# Altium project PCB_Project.PrjPcb (part 2 of 3)

## Sheet LED_JTAG.schdoc
size 297 x 210 mm; Symbol: Sheet-Symbol_A4; Company: 嘉立创EDA; Version: V1.0; Page Size: A4; @Project Name: prj_extend_and_core_board_7_8; @Page Count: 7; @Update Date: 2024-08-12; @Create Date: 2024-08-09; @Schematic Name: Schematic1; @Page No: 6; @Page Name: LED/JTAG; Device: Sheet-Symbol_A4
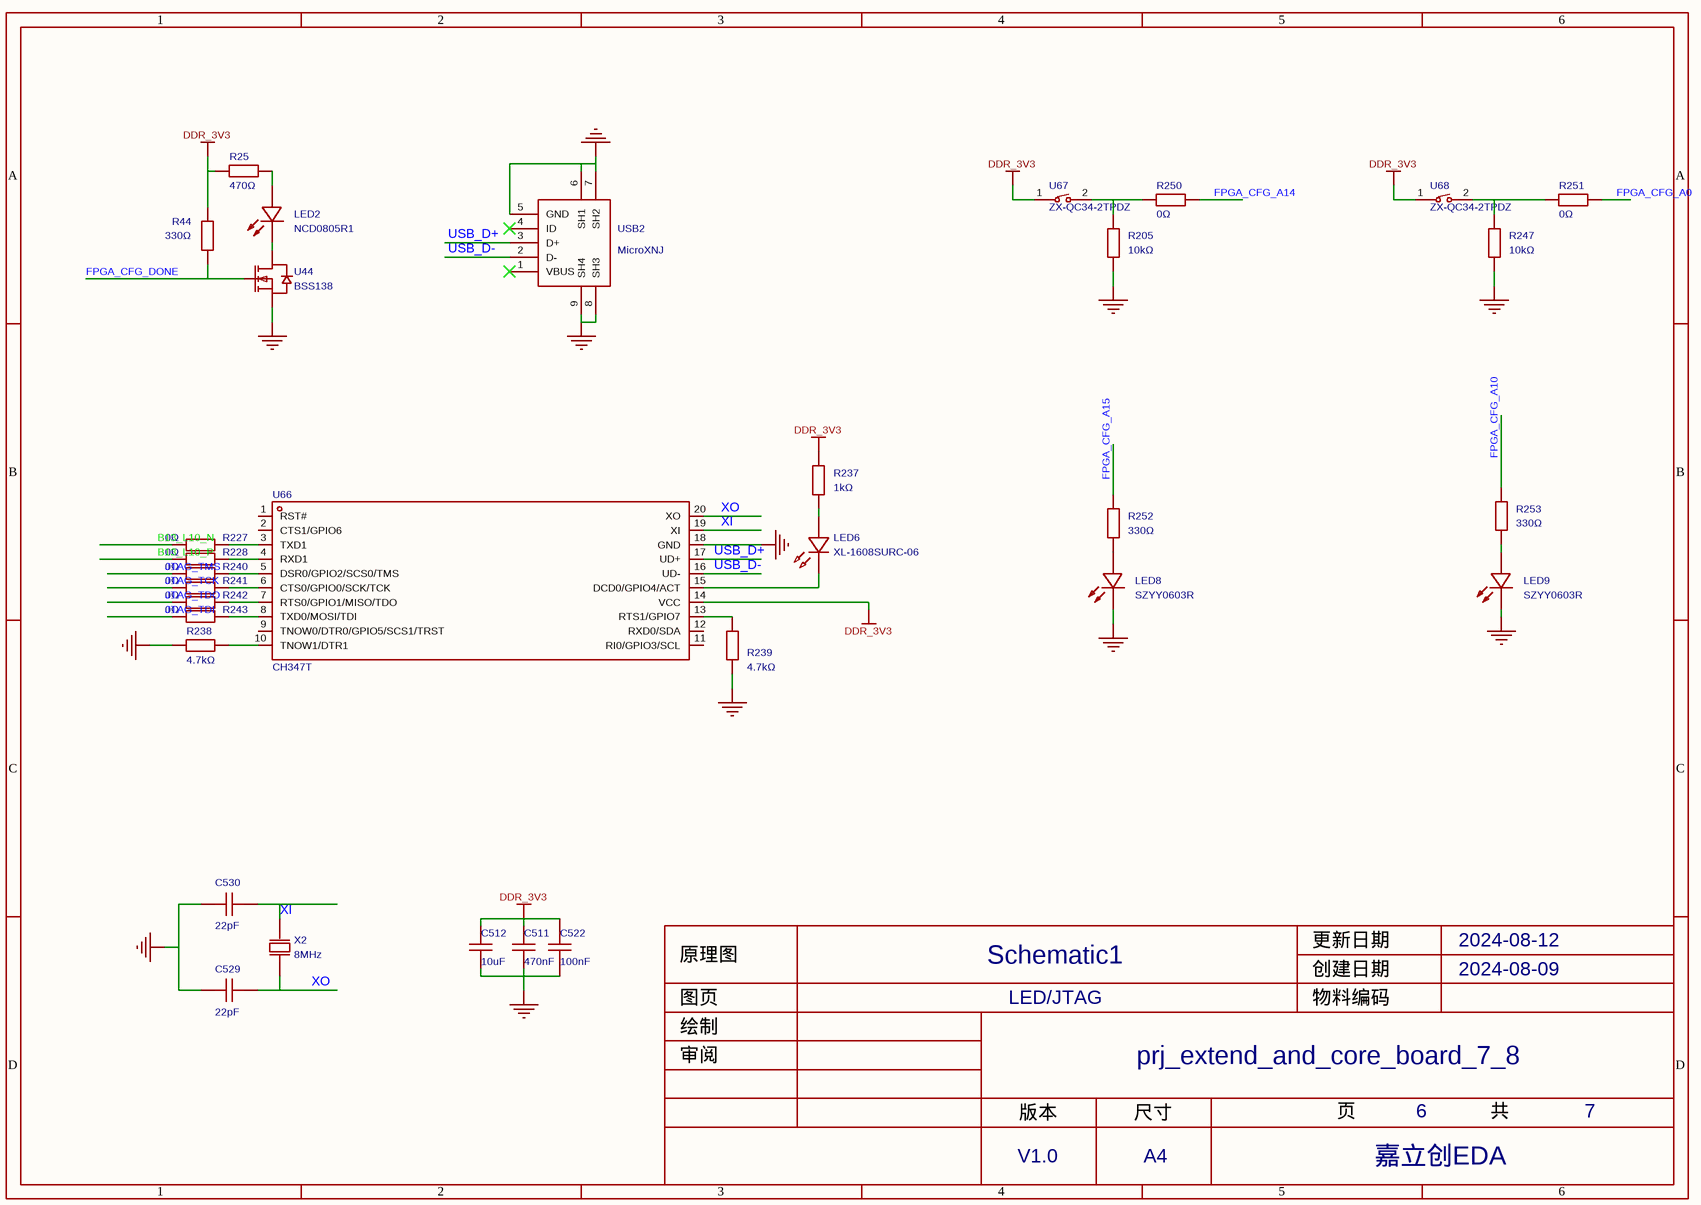
[diagram p7: LED_JTAG.schdoc]

### Parts
C511  470nF  [C0402]
C512  10uF  [C0402]
C522  100nF  [C0402]
C529  22pF  [C0402]
C530  22pF  [C0402]
LED2  NCD0805R1  [LED0805-R-RD]
LED6  XL-1608SURC-06  [LED0603-RD_RED]
LED8  SZYY0603R  [LED0603-R-RD]
LED9  SZYY0603R  [LED0603-R-RD]
R25  470Ω  [R0603]
R44  330Ω  [R0603]
R205  10kΩ  [R0603]
R227  0Ω  [R0402]
R228  0Ω  [R0402]
R237  1kΩ  [R0402]
R238  4.7kΩ  [R0402]
R239  4.7kΩ  [R0402]
R240  0Ω  [R0402]
R241  0Ω  [R0402]
R242  0Ω  [R0402]
R243  0Ω  [R0402]
R247  10kΩ  [R0603]
R250  0Ω  [R0402]
R251  0Ω  [R0402]
R252  330Ω  [R0402]
R253  330Ω  [R0402]
U44  BSS138  [SOT-23-3_L2.9-W1.3-P1.90-LS2.4-BR]
U66  CH347T  [TSSOP-20_L6.5-W4.4-P0.65-LS6.4-BL]
U67  ZX-QC34-2TPDZ  [KEY-SMD_L3.9-W3.0-LS5.0-EH]
U68  ZX-QC34-2TPDZ  [KEY-SMD_L3.9-W3.0-LS5.0-EH]
USB2  MicroXNJ  [MICRO-USB-SMD_MICROXNJ]
X2  8MHz  [CRYSTAL-SMD_L5.0-W3.2]

### Nets
DDR_3V3: C511.2 C512.2 C522.2 R25.2 R44.2 R237.2 U66.14(VCC) U67.1 U68.1
GND: C511.1 C512.1 C522.1 C529.2 C530.2 LED8.2(-) LED9.2(-) R205.1 R238.1 R239.1 R247.1 U44.2(S) U66.18(GND) USB2.5(GND) USB2.6(SH1) USB2.7(SH2) USB2.8(SH3) USB2.9(SH4)
B13_L10_N: R227.2
B13_L10_P: R228.2
FPGA_CFG_A0: R251.2
FPGA_CFG_A10: R253.2
FPGA_CFG_A14: R250.2
FPGA_CFG_A15: R252.2
FPGA_CFG_DONE: R44.1 U44.1(G)
JTAG_TCK: R241.2
JTAG_TDI: R243.2
JTAG_TDO: R242.2
JTAG_TMS: R240.2
USB_D+: U66.17(UD+) USB2.3(D+)
USB_D-: U66.16(UD-) USB2.2(D-)
XI: C530.1 U66.19(XI) X2.2(OSC2)
XO: C529.1 U66.20(XO) X2.1(OSC1)
NetLED2_1: LED2.1(+) R25.1
NetLED2_2: LED2.2(-) U44.3(D)
NetLED6_1: LED6.1(K) U66.15(DCD0/GPIO4/ACT)
NetLED6_2: LED6.2(A) R237.1
NetLED8_1: LED8.1(+) R252.1
NetLED9_1: LED9.1(+) R253.1
NetR205_2: R205.2 R250.1 U67.2
NetR227_1: R227.1 U66.3(TXD1)
NetR228_1: R228.1 U66.4(RXD1)
NetR238_2: R238.2 U66.10(TNOW1/DTR1)
NetR239_2: R239.2 U66.13(RTS1/GPIO7)
NetR240_1: R240.1 U66.5(DSR0/GPIO2/SCS0/TMS)
NetR241_1: R241.1 U66.6(CTS0/GPIO0/SCK/TCK)
NetR242_1: R242.1 U66.7(RTS0/GPIO1/MISO/TDO)
NetR243_1: R243.1 U66.8(TXD0/MOSI/TDI)
NetR247_2: R247.2 R251.1 U68.2

Not connected (* = marked no-connect by the designer): U66 1(RST#) 2(CTS1/GPIO6) 9(TNOW0/DTR0/GPIO5/SCS1/TRST) 11(RI0/GPIO3/SCL) 12(RXD0/SDA); USB2 1(VBUS)* 4(ID)*

### Notes on the sheet
- 1
- 2
- 3
- 4
- 5
- 6
- A
- B
- C
- 更新日期
- 2024-08-12
- 原理图
- 图页
- Schematic1
- LED/JTAG
- 创建日期
- 物料编码
- 2024-08-09
- D
- 审阅
- 绘制
- prj_extend_and_core_board_7_8
- 版本
- V1.0
- 尺寸
- A4
- 页
- 嘉立创EDA
- 共
- 7

### Library data of the parts
C511 = CL05A474KP5NNNC: 容值:470nF;精度:±10%;额定电压:10V;材质(温度系数):X5R;; Manufacturer: SAMSUNG(三星); AddInBom: yes; ModelId: 36a51122f27c49738f86b3bfa98863e0; ModelName: C0402_L1.0-W0.5-H0.5; ModelTransform: 39.37,19.685,0,0,0,0,0,0,0; Tolerance: ±10%; Voltage Rated: 10V; Temperature Coefficient: X5R; Symbol: CL05A474KP5NNNC; Device: CL05A474KP5NNNC; LCSC Part Name: 470nF ±10% 10V; SupplierPart: C47339; ManufacturerPart: CL05A474KP5NNNC; Supplier Footprint: 0402; JLCPCB Part Class: 扩展库; Datasheet: https://atta.szlcsc.com/upload/public/pdf/source/20160218/1457707763339.pdf; Supplier: LCSC; ConvertToPcb: yes; FootprintName: C0402; Value: 470nF
C512 = CL05A106MQ5NUNC: 容值:10uF;精度:±20%;额定电压:6.3V;材质(温度系数):X5R;; Manufacturer: SAMSUNG(三星); AddInBom: yes; ModelId: 36a51122f27c49738f86b3bfa98863e0; ModelName: C0402_L1.0-W0.5-H0.5; ModelTransform: 39.37,19.685,0,0,0,0,0,0,0; Tolerance: ±20%; Voltage Rated: 6.3V; Temperature Coefficient: X5R; Symbol: CL05A106MQ5NUNC; Device: CL05A106MQ5NUNC; Supplier: LCSC; Manufacturer Part: CL05A106MQ5NUNC; Value: 10uF; Supplier Part: C15525; JLCPCB Part Class: 基础库; LCSC Part Name: 10uF ±20% 6.3V; Supplier Footprint: 0402; Datasheet: https://atta.szlcsc.com/upload/public/pdf/source/20220823/2B02EE04F8F211D38A52DCB16EB6BEBA.pdf; ConvertToPcb: yes; FootprintName: C0402
C522 = GRM155R71C104KA88D: 容值:100nF;精度:±10%;额定电压:16V;材质(温度系数):X7R;; Manufacturer: muRata(村田); AddInBom: yes; ModelId: 36a51122f27c49738f86b3bfa98863e0; ModelName: C0402_L1.0-W0.5-H0.5; ModelTransform: 39.37,19.685,0,0,0,0,0,0,0; Tolerance: ±10%; Voltage Rated: 16V; Temperature Coefficient: X7R; Symbol: GRM155R71C104KA88D; Device: GRM155R71C104KA88D; LCSC Part Name: 100nF ±10% 16V; SupplierPart: C71629; ManufacturerPart: GRM155R71C104KA88D; Supplier Footprint: 0402; JLCPCB Part Class: 扩展库; Datasheet: https://atta.szlcsc.com/upload/public/pdf/source/20161108/1478586448742.pdf; Supplier: LCSC; ConvertToPcb: yes; FootprintName: C0402; Value: 100nF
C529 C530 = CC0402FRNPO9BN220: 容值:22pF;精度:±1%;额定电压:50V;材质(温度系数):NP0;; Manufacturer: YAGEO(国巨); AddInBom: yes; ModelId: 36a51122f27c49738f86b3bfa98863e0; ModelName: C0402_L1.0-W0.5-H0.5; ModelTransform: 39.37,19.685,0,0,0,0,0,0,0; Tolerance: ±1%; Voltage Rated: 50V; Temperature Coefficient: NP0; Symbol: CC0402FRNPO9BN220; Device: CC0402FRNPO9BN220; Supplier: LCSC; Supplier Part: C277482; Manufacturer Part: CC0402FRNPO9BN220; Value: 22pF; JLCPCB Part Class: 扩展库; LCSC Part Name: 22pF ±1% 50V; Supplier Footprint: 0402; Datasheet: https://atta.szlcsc.com/upload/public/pdf/source/20181008/C309499_21CC21451B82C39E3D92150FD6B30293.pdf; ConvertToPcb: yes; FootprintName: C0402
LED2 = NCD0805R1: 灯头类型:-;发光颜色:红色;正向电压(VF):1.6V~2.6V;功率:65mW;正向电流:20mA;主波长:615nm~630nm;二极管配置:独立二极管;透镜颜色:无色透明透镜;色温:-;发光强度:67mcd~195mcd;发光角度:130°;载带方式:-;工作温度:-30℃~+85℃;; Manufacturer: 国星光电; Symbol: FC-2012HRK-620D; AddInBom: yes; ModelId: 6ccd75a2b5134d6ab756ecf3c14a7290; ModelName: LED0805-RD; ModelTransform: 79.527,49.2125,0,0,0,0,0,0,0; Emitted Color: 红色; Power Dissipation: 65mW; Forward Current: 20mA; Diode Configuration: 独立二极管; Lens Color: 无色透明透镜; Viewing Angle: 130°; Device: NCD0805R1; Supplier: LCSC; Manufacturer Part: NCD0805R1; Supplier Part: C84256; JLCPCB Part Class: 基础库; LCSC Part Name: NCD0805R1; Supplier Footprint: 0805; Datasheet: https://atta.szlcsc.com/upload/public/pdf/source/20200820/C84256_F0A75A43B3EAD75808600A0514C76B99.pdf; ConvertToPcb: yes; FootprintName: LED0805-R-RD; Lamp Holder Type: -; Forward Voltage (VF): 1.6V~2.6V; Dominant Wavelength: 615nm~630nm; Peak Wavelength: -; Color Temperature: -; Luminous Intensity: 67mcd~195mcd; Mounting Sytle: -; Operating Temperature: -30℃~+85℃
LED6 = XL-1608SURC-06: 发光颜色:红色;功率:55mW;正向电流:25mA;主波长:617nm~621nm;透镜颜色:无色透明透镜;色温:-;发光角度:120°;载带方式:正贴;工作温度:-30℃~+85℃;; Manufacturer: XINGLIGHT(成兴光); AddInBom: yes; ModelId: 74041d3a270d435c8600a9ab9b7641c0; ModelTransform: 63.7794,31.496,0,0,0,0,0,0,0; Emitted Color: 红色; Power Dissipation: 55mW; Forward Current: 25mA; Peak Wavelength: 623nm; Lens Color: 无色透明透镜; Viewing Angle: 120°; Mounting Sytle: 正贴; Symbol: XL-1608SURC-06; Device: XL-1608SURC-06; Supplier: LCSC; Supplier Part: C965799; Manufacturer Part: XL-1608SURC-06; JLCPCB Part Class: 扩展库; LCSC Part Name: XL-1608SURC-06; Supplier Footprint: 0603; Datasheet: https://atta.szlcsc.com/upload/public/pdf/source/20221102/D860AFDD1CDB02C5A8064103A32707E2.pdf; ConvertToPcb: yes; FootprintName: LED0603-RD_RED; ModelName: LED0603-RD_RED; Dominant Wavelength: 617nm~621nm; Color Temperature: -; Operating Temperature: -30℃~+85℃
LED8 LED9 = SZYY0603R: 发光颜色:红色;功率:40mW;正向电流:20mA;主波长:615nm~630nm;二极管配置:-;透镜颜色:无色透明透镜;色温:-;发光角度:120°;载带方式:-;工作温度:-40℃~+85℃;; Manufacturer: yongyu(永裕光电); AddInBom: yes; ModelId: 8d3b40c214c440ee9cb5435c7b23d347; ModelTransform: 63.7794,31.496,0,0,0,0,0,0,0; Emitted Color: 红色; Power Dissipation: 40mW; Forward Current: 20mA; Peak Wavelength: 645nm; Lens Color: 无色透明透镜; Viewing Angle: 120°; Symbol: SZYY0603R; Device: SZYY0603R; LCSC Part Name: 红灯; SupplierPart: C434419; ManufacturerPart: SZYY0603R; Supplier Footprint: 0603; JLCPCB Part Class: 扩展库; Datasheet: https://atta.szlcsc.com/upload/public/pdf/source/20191204/C434419_0B955C1F73FF88449D9A795B6FF49070.pdf; Supplier: LCSC; ConvertToPcb: yes; FootprintName: LED0603-R-RD; ModelName: LED0603-R-RD; Dominant Wavelength: 615nm~630nm; Diode Configuration: -; Color Temperature: -; Mounting Sytle: -; Operating Temperature: -40℃~+85℃
R25 = 0603WAF4700T5E: 电阻类型:厚膜电阻;阻值:470Ω;精度:±1%;功率:100mW;最大工作电压:75V;温度系数:±100ppm/℃;; Manufacturer: UNI-ROYAL(厚声); AddInBom: yes; ModelId: fc143cca1e79419f9cd78b61e9279f08; ModelTransform: 31.8897,63.7794,0,90,0,0,0,0,0; Tolerance: ±1%; Power(Watts): 100mW; Overload Voltage (Max): 75V; Symbol: 0603WAF4700T5E; Device: 0603WAF4700T5E; Supplier: LCSC; Manufacturer Part: 0603WAF4700T5E; Supplier Part: C23179; Value: 470Ω; JLCPCB Part Class: 基础库; LCSC Part Name: 470Ω ±1% 100mW 厚膜电阻; Supplier Footprint: 0603; Datasheet: https://atta.szlcsc.com/upload/public/pdf/source/20200306/C422600_1E6D84923E4A46A82E41ADD87F860B5C.pdf; ConvertToPcb: yes; FootprintName: R0603; ModelName: R0603; Type: 厚膜电阻; Temperature Coefficient: ±100ppm/℃; Operating Temperature Range: -55℃~+155℃
R44 = 0603WAF3300T5E: 电阻类型:厚膜电阻;阻值:330Ω;精度:±1%;功率:100mW;最大工作电压:75V;温度系数:±100ppm/℃;; Manufacturer: UNI-ROYAL(厚声); AddInBom: yes; ModelId: fc143cca1e79419f9cd78b61e9279f08; ModelTransform: 31.8897,63.7794,0,90,0,0,0,0,0; Tolerance: ±1%; Power(Watts): 100mW; Overload Voltage (Max): 75V; Symbol: 0603WAF3300T5E; Device: 0603WAF3300T5E; Supplier: LCSC; Manufacturer Part: 0603WAF3300T5E; Supplier Part: C23138; Value: 330Ω; JLCPCB Part Class: 基础库; LCSC Part Name: 330Ω ±1% 100mW 厚膜电阻; Supplier Footprint: 0603; Datasheet: https://atta.szlcsc.com/upload/public/pdf/source/20200306/C422600_1E6D84923E4A46A82E41ADD87F860B5C.pdf; ConvertToPcb: yes; FootprintName: R0603; ModelName: R0603; Type: 厚膜电阻; Temperature Coefficient: ±100ppm/℃; Operating Temperature Range: -55℃~+155℃
R205 R247 = 0603WAF1002T5E: 电阻类型:厚膜电阻;阻值:10kΩ;精度:±1%;功率:100mW;最大工作电压:75V;温度系数:±100ppm/℃;; Manufacturer: UNI-ROYAL(厚声); AddInBom: yes; ModelId: fc143cca1e79419f9cd78b61e9279f08; ModelTransform: 31.8897,63.7794,0,90,0,0,0,0,0; Tolerance: ±1%; Power(Watts): 100mW; Overload Voltage (Max): 75V; Symbol: 0603WAF1002T5E; Device: 0603WAF1002T5E; Supplier: LCSC; Manufacturer Part: 0603WAF1002T5E; Supplier Part: C25804; Value: 10kΩ; JLCPCB Part Class: 基础库; LCSC Part Name: 厚膜电阻 10kΩ ±1% 100mW; Supplier Footprint: 0603; Datasheet: https://atta.szlcsc.com/upload/public/pdf/source/20200306/C422600_1E6D84923E4A46A82E41ADD87F860B5C.pdf; ConvertToPcb: yes; FootprintName: R0603; ModelName: R0603; Type: 厚膜电阻; Temperature Coefficient: ±100ppm/℃; Operating Temperature Range: -55℃~+155℃
R227 R228 R240-R243 R250 R251 = 0402WGF0000TCE: 电阻类型:厚膜电阻;阻值:0Ω;精度:±1%;功率:62.5mW;最大工作电压:50V;温度系数:±800ppm/℃;; Manufacturer: UNI-ROYAL(厚声); AddInBom: yes; ModelId: 671aefced39d4c318694bba8bd8efd39; ModelName: R0402_L1.0-W0.5-H0.5; ModelTransform: 39.37,19.685,0,0,0,0,0,0.0005,0; Tolerance: ±1%; Power(Watts): 62.5mW; Overload Voltage (Max): 50V; Symbol: 0402WGF0000TCE; Device: 0402WGF0000TCE; Supplier: LCSC; Manufacturer Part: 0402WGF0000TCE; Supplier Part: C17168; Value: 0Ω; JLCPCB Part Class: 基础库; LCSC Part Name: 0Ω ±1% 62.5mW 厚膜电阻; Supplier Footprint: 0402; Datasheet: https://atta.szlcsc.com/upload/public/pdf/source/20200306/C422600_1E6D84923E4A46A82E41ADD87F860B5C.pdf; ConvertToPcb: yes; FootprintName: R0402; Type: 厚膜电阻; Temperature Coefficient: ±800ppm/℃; Operating Temperature Range: -55℃~+155℃
R237 = 0402WGF1001TCE: 电阻类型:厚膜电阻;阻值:1kΩ;精度:±1%;功率:62.5mW;最大工作电压:50V;温度系数:±100ppm/℃;; Manufacturer: UNI-ROYAL(厚声); AddInBom: yes; ModelId: 671aefced39d4c318694bba8bd8efd39; ModelName: R0402_L1.0-W0.5-H0.5; ModelTransform: 39.37,19.685,0,0,0,0,0,0.0005,0; Tolerance: ±1%; Power(Watts): 62.5mW; Overload Voltage (Max): 50V; Symbol: 0402WGF1001TCE; Device: 0402WGF1001TCE; Supplier: LCSC; Manufacturer Part: 0402WGF1001TCE; Supplier Part: C11702; Value: 1kΩ; JLCPCB Part Class: 基础库; LCSC Part Name: 1kΩ ±1% 62.5mW 厚膜电阻; Supplier Footprint: 0402; Datasheet: https://atta.szlcsc.com/upload/public/pdf/source/20200306/C422600_1E6D84923E4A46A82E41ADD87F860B5C.pdf; ConvertToPcb: yes; FootprintName: R0402; Type: 厚膜电阻; Temperature Coefficient: ±100ppm/℃; Operating Temperature Range: -55℃~+155℃
R238 R239 = 0402WGF4701TCE: 电阻类型:厚膜电阻;阻值:4.7kΩ;精度:±1%;功率:62.5mW;最大工作电压:50V;温度系数:±100ppm/℃;; Manufacturer: UNI-ROYAL(厚声); AddInBom: yes; ModelId: 671aefced39d4c318694bba8bd8efd39; ModelName: R0402_L1.0-W0.5-H0.5; ModelTransform: 39.37,19.685,0,0,0,0,0,0.0005,0; Tolerance: ±1%; Power(Watts): 62.5mW; Overload Voltage (Max): 50V; Symbol: 0402WGF4701TCE; Device: 0402WGF4701TCE; Supplier: LCSC; Manufacturer Part: 0402WGF4701TCE; Supplier Part: C25900; Value: 4.7kΩ; JLCPCB Part Class: 基础库; LCSC Part Name: 4.7kΩ ±1% 62.5mW 厚膜电阻; Supplier Footprint: 0402; Datasheet: https://atta.szlcsc.com/upload/public/pdf/source/20200306/C422600_1E6D84923E4A46A82E41ADD87F860B5C.pdf; ConvertToPcb: yes; FootprintName: R0402; Type: 厚膜电阻; Temperature Coefficient: ±100ppm/℃; Operating Temperature Range: -55℃~+155℃
R252 R253 = 0402WGF3300TCE: 电阻类型:厚膜电阻;阻值:330Ω;精度:±1%;功率:62.5mW;最大工作电压:50V;温度系数:±100ppm/℃;; Manufacturer: UNI-ROYAL(厚声); AddInBom: yes; ModelId: 671aefced39d4c318694bba8bd8efd39; ModelName: R0402_L1.0-W0.5-H0.5; ModelTransform: 39.37,19.685,0,0,0,0,0,0.0005,0; Tolerance: ±1%; Power(Watts): 62.5mW; Overload Voltage (Max): 50V; Symbol: 0402WGF3300TCE; Device: 0402WGF3300TCE; Supplier: LCSC; Manufacturer Part: 0402WGF3300TCE; Supplier Part: C25104; Value: 330Ω; JLCPCB Part Class: 基础库; LCSC Part Name: 330Ω ±1% 62.5mW 厚膜电阻; Supplier Footprint: 0402; Datasheet: https://atta.szlcsc.com/upload/public/pdf/source/20200306/C422600_1E6D84923E4A46A82E41ADD87F860B5C.pdf; ConvertToPcb: yes; FootprintName: R0402; Type: 厚膜电阻; Temperature Coefficient: ±100ppm/℃; Operating Temperature Range: -55℃~+155℃
U44 = BSS138_C7420339: 类型:N沟道;漏源电压(Vdss):50V;连续漏极电流(Id):340mA;功率(Pd):350mW;导通电阻(RDS(on)@Vgs,Id):2.5Ω@10V,0.34A;阈值电压(Vgs(th)@Id):1.6V@250uA;; Manufacturer: 宏迦橙; AddInBom: yes; ModelId: c62791f0466c4ae2a892c056b845b0ca; ModelName: SOT-23-3P_L2.9-W1.3-H1.0-LS2.4-P0.95; ModelTransform: 98.425,114.173,0,180,0,0,0.0005,-0.0005,0; Drain Source Voltage (Vdss): 50V; Continuous Drain Current (Id): 340mA; Power Dissipation (Pd): 350mW; Total Gate Charge (Qg@Vgs): 1.7nC@10V; Input Capacitance (Ciss@Vds): 17.5pF@25V; Reverse Transfer Capacitance (Crss@Vds): 6.5pF@25V; Symbol: BSS138_C7420339; Device: BSS138_C7420339; Supplier: LCSC; Supplier Part: C7420339; Manufacturer Part: BSS138; JLCPCB Part Class: 扩展库; LCSC Part Name: N沟道 耐压:50V 电流:340mA; Supplier Footprint: SOT-23; Datasheet: https://atta.szlcsc.com/upload/public/pdf/source/20230828/FA091145E476A230936B8E03226CDB87.pdf; ConvertToPcb: yes; FootprintName: SOT-23-3_L2.9-W1.3-P1.90-LS2.4-BR; Type: N沟道; Drain Source On Resistance (RDS(on)@Vgs,Id): 2.5Ω@10V,0.34A; Gate Threshold Voltage (Vgs(th)@Id): 1.6V@250uA; Operating Temperature: -55℃~+150℃
U66 = CH347T: Manufacturer: WCH(南京沁恒); AddInBom: yes; ModelId: c491f68934b34c649df5890a1d97cd0f; ModelName: TSSOP-20_L6.5-W4.4-H1.0-LS6.4-P0.65; ModelTransform: 251.969,255.906,0,90,0,0,0.0005,0,0; Symbol: CH347T; Device: CH347T; LCSC Part Name: CH347T; SupplierPart: C5122332; ManufacturerPart: CH347T; Supplier Footprint: TSSOP-20; JLCPCB Part Class: 扩展库; Datasheet: https://atta.szlcsc.com/upload/public/pdf/source/20220727/C146BDC59808820E6CF38786842D37DD.pdf; Supplier: LCSC; ConvertToPcb: yes; FootprintName: TSSOP-20_L6.5-W4.4-P0.65-LS6.4-BL
U67 U68 = ZX-QC34-2TPDZ: 电路结构:单刀单掷;按钮形状:圆形按钮;作用力:2.6N;安装方式:立贴;开关长度:3mm;开关宽度:4mm;开关高度:2mm;带支架:不带;触点电流:50mA;额定电压(AC):250V;额定电压(DC):12V;绝缘电阻:100MΩ;机械寿命:10万次;; Manufacturer: Megastar(兆星); AddInBom: yes; ModelId: 887c37aacc9c4feb87b9442b15e50881; ModelTransform: 196.85,118.5037,0,0,0,0,0,0,-19.685; Circuit: 单刀单掷; Actuator Style: 圆形按钮; Operating Force: 2.6N; Switch Length: 3mm; Switch Width: 4mm; Switch Height: 2mm; Strike Gundam: 不带; Contact Current: 50mA; Voltage Rating (AC): 250V; Voltage Rating (DC): 12V; Insulation Resistance: 100MΩ; Actuator/Cap Color: 黑色; Pin Style: 鸥翼型; Mechanical Life: 10万次; Symbol: ZX-QC34-2TPDZ; Device: ZX-QC34-2TPDZ; LCSC Part Name: 3*4*2贴片开关带柱; SupplierPart: C7470219; ManufacturerPart: ZX-QC34-2TPDZ; Supplier Footprint: SMD; JLCPCB Part Class: 扩展库; Datasheet: https://atta.szlcsc.com/upload/public/pdf/source/20230724/D2731FAADF93973E25928DE23F241F8A.pdf; Supplier: LCSC; ConvertToPcb: yes; FootprintName: KEY-SMD_L3.9-W3.0-LS5.0-EH; ModelName: KEY-SMD_L3.9-W3.0-LS5.0-EH; Mounting Style: 立贴; Operating Temperature: -30℃~+80℃
USB2 = MicroXNJ: 连接器类型:Micro-B;标准:USB 2.0;公母:母;端口数量:1;触点数量:5P;安装方式:卧贴;额定电流 - 电源:1A;工作温度范围:-20℃~+85℃;; Manufacturer: SHOU HAN(首韩); AddInBom: yes; ModelId: 09cd4e00f84d4aa48ba25c78094c25a1; ModelName: MICRO-USB-SMD_MICROXNJ-A; ModelTransform: 308.47812,229.61104,0,0,0,0,0,-60.039,-47.244; Gender: 母; Number of Ports: 1; Number of Contacts: 5P; Current Rating - Power (Max): 1A; Symbol: MICROXNJ; Device: MicroXNJ; Supplier: LCSC; Supplier Part: C404969; Manufacturer Part: MicroXNJ; JLCPCB Part Class: 扩展库; LCSC Part Name: Micro-B 母 卧贴; Supplier Footprint: SMD; Datasheet: https://atta.szlcsc.com/upload/public/pdf/source/20220415/2494EDFF499AF6F852F7C820374B6AF3.pdf; ConvertToPcb: yes; FootprintName: MICRO-USB-SMD_MICROXNJ; Connector Type: Micro-B; Standard: USB 2.0; Mounting Style: 卧贴; Operating Temperature Range: -20℃~+85℃
X2 = X50328MSB2GI: 晶振类型:贴片晶振;频率:8MHz;常温频差:±10ppm;外接负载电容:20pF;频率稳定度(全温):±20ppm;; Manufacturer: YXC(扬兴晶振); AddInBom: yes; ModelId: d7c39c66443246ff83c2003c1e1eb6f1; ModelTransform: 196.85,125.984,0,0,0,0,0,0,0; Crystal Type: 贴片晶振; Normal temperature Frequency Tolerance: ±10ppm; External load capacitor: 20pF; Frequency Stability(Full temperature range): ±20ppm; Symbol: X50328MSB2GI; Device: X50328MSB2GI; LCSC Part Name: 8MHz ±10ppm 20pF YSX530GA; SupplierPart: C115962; ManufacturerPart: X50328MSB2GI; Supplier Footprint: SMD5032; JLCPCB Part Class: 基础库; Datasheet: https://atta.szlcsc.com/upload/public/pdf/source/20240329/44922B0AF7B60E58E9B66993B6077277.pdf; Supplier: LCSC; ConvertToPcb: yes; FootprintName: CRYSTAL-SMD_L5.0-W3.2; ModelName: CRYSTAL-SMD_L5.0-W3.2; Value: 8MHz; Operating Temperature: -40℃~+85℃

## Sheet Power1.schdoc
size 420 x 298 mm; Symbol: Sheet-Symbol_A4; Company: 嘉立创EDA; Version: V1.0; Page Size: A4; @Project Name: prj_extend_and_core_board_7_8; @Page Count: 7; @Update Date: 2024-08-09; @Create Date: 2024-08-09; @Schematic Name: Schematic1; @Page No: 1; @Page Name: Power1; Device: Sheet-Symbol_A4
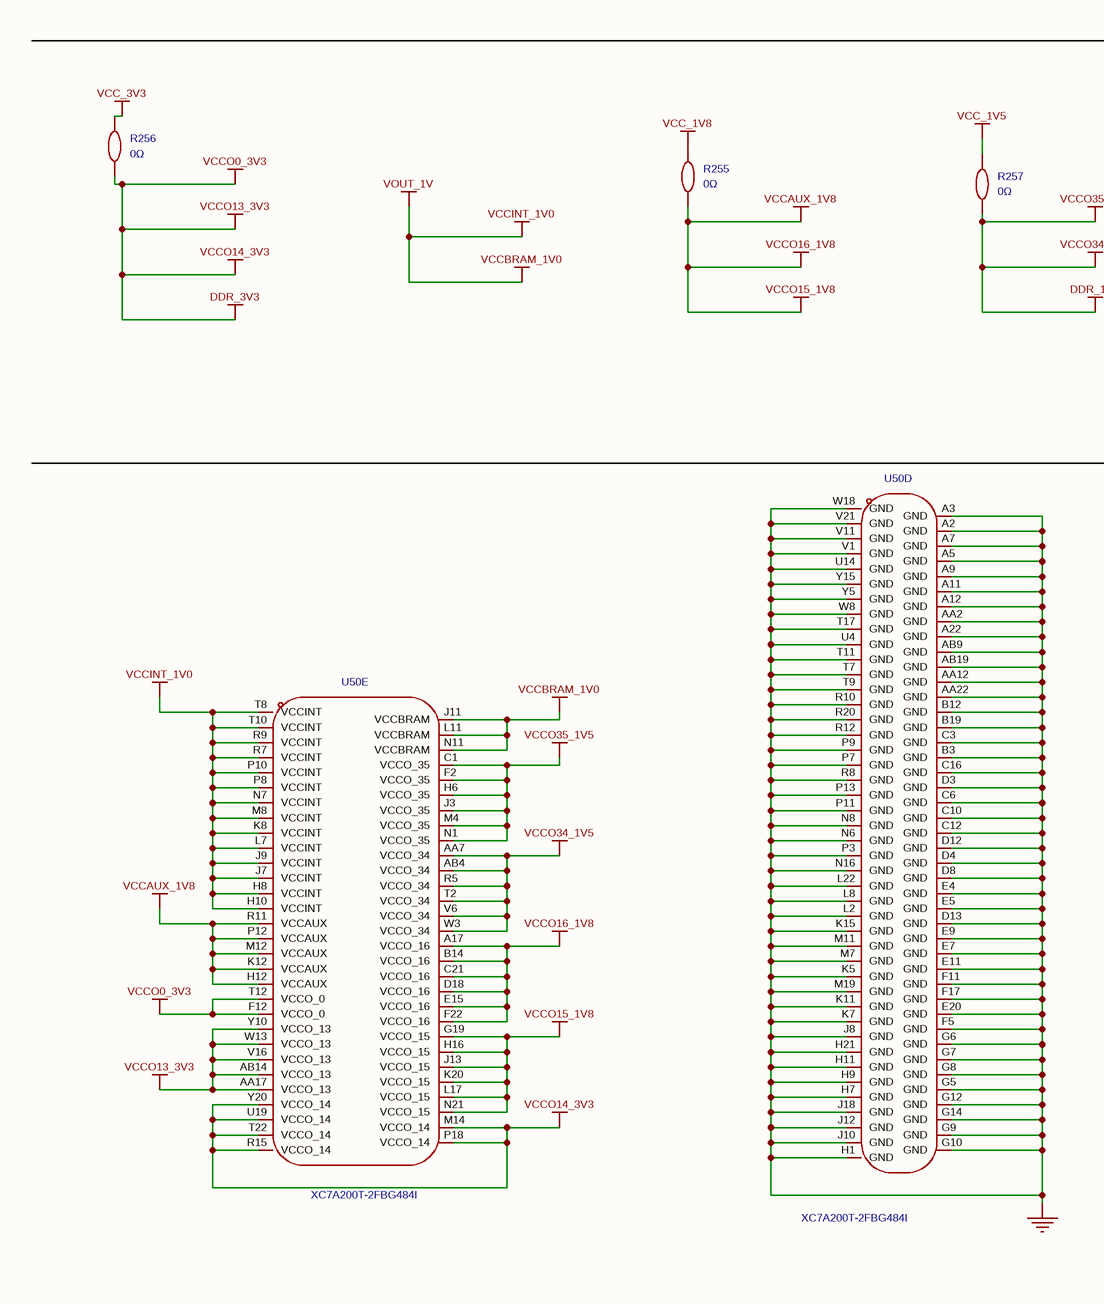
[diagram p8: Power1.schdoc, left]
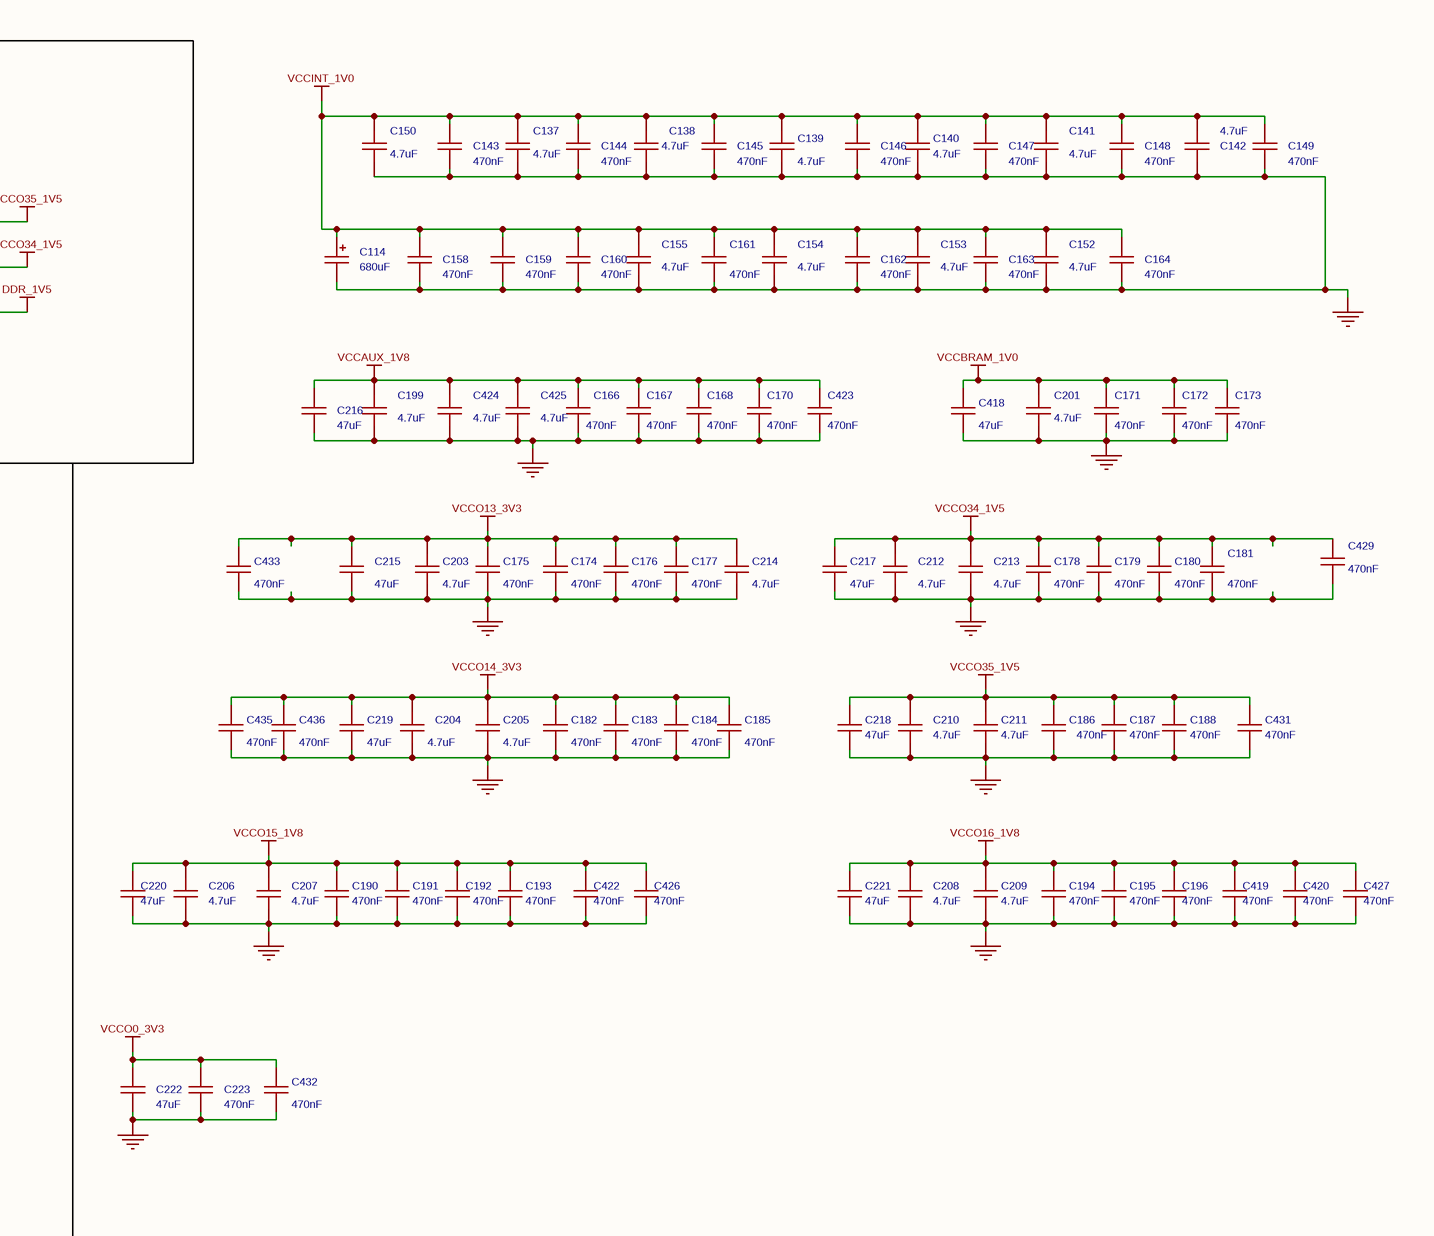
[diagram p9: Power1.schdoc, right]

### Parts
C114  680uF  [CAP-SMD_L7.3-W4.3-R-RD]
C137  4.7uF  [C0402]
C138  4.7uF  [C0402]
C139  4.7uF  [C0402]
C140  4.7uF  [C0402]
C141  4.7uF  [C0402]
C142  4.7uF  [C0402]
C143  470nF  [C0402]
C144  470nF  [C0402]
C145  470nF  [C0402]
C146  470nF  [C0402]
C147  470nF  [C0402]
C148  470nF  [C0402]
C149  470nF  [C0402]
C150  4.7uF  [C0402]
C152  4.7uF  [C0402]
C153  4.7uF  [C0402]
C154  4.7uF  [C0402]
C155  4.7uF  [C0402]
C158  470nF  [C0402]
C159  470nF  [C0402]
C160  470nF  [C0402]
C161  470nF  [C0402]
C162  470nF  [C0402]
C163  470nF  [C0402]
C164  470nF  [C0402]
C166  470nF  [C0402]
C167  470nF  [C0402]
C168  470nF  [C0402]
C170  470nF  [C0402]
C171  470nF  [C0402]
C172  470nF  [C0402]
C173  470nF  [C0402]
C174  470nF  [C0402]
C175  470nF  [C0402]
C176  470nF  [C0402]
C177  470nF  [C0402]
C178  470nF  [C0402]
C179  470nF  [C0402]
C180  470nF  [C0402]
C181  470nF  [C0402]
C182  470nF  [C0402]
C183  470nF  [C0402]
C184  470nF  [C0402]
C185  470nF  [C0402]
C186  470nF  [C0402]
C187  470nF  [C0402]
C188  470nF  [C0402]
C190  470nF  [C0402]
C191  470nF  [C0402]
C192  470nF  [C0402]
C193  470nF  [C0402]
C194  470nF  [C0402]
C195  470nF  [C0402]
C196  470nF  [C0402]
C199  4.7uF  [C0402]
C201  4.7uF  [C0402]
C203  4.7uF  [C0402]
C204  4.7uF  [C0402]
C205  4.7uF  [C0402]
C206  4.7uF  [C0402]
C207  4.7uF  [C0402]
C208  4.7uF  [C0402]
C209  4.7uF  [C0402]
C210  4.7uF  [C0402]
C211  4.7uF  [C0402]
C212  4.7uF  [C0402]
C213  4.7uF  [C0402]
C214  4.7uF  [C0402]
C215  47uF  [C0603]
C216  47uF  [C0603]
C217  47uF  [C0603]
C218  47uF  [C0603]
C219  47uF  [C0603]
C220  47uF  [C0603]
C221  47uF  [C0603]
C222  47uF  [C0603]
C223  470nF  [C0402]
C418  47uF  [C0603]
C419  470nF  [C0402]
C420  470nF  [C0402]
C422  470nF  [C0402]
C423  470nF  [C0402]
C424  4.7uF  [C0402]
C425  4.7uF  [C0402]
C426  470nF  [C0402]
C427  470nF  [C0402]
C429  470nF  [C0402]
C431  470nF  [C0402]
C432  470nF  [C0402]
C433  470nF  [C0402]
C435  470nF  [C0402]
C436  470nF  [C0402]
R255  0Ω  [R0805]
R256  0Ω  [R0805]
R257  0Ω  [R0805]
U50  XC7A200T-2FBG484I  [FBGA-484_L23.0-W23.0-R22-C22-P1.00-TL]  (parts D,E of 5)

### Nets
DDR_1V5: C178.2 C179.2 C180.2 C181.2 C186.2 C187.2 C188.2 C210.2 C211.2 C212.2 C213.2 C217.2 C218.2 C429.2 C431.2 R257.1 U50.AA7(VCCO_34) U50.AB4(VCCO_34) U50.C1(VCCO_35) U50.F2(VCCO_35) U50.H6(VCCO_35) U50.J3(VCCO_35) U50.M4(VCCO_35) U50.N1(VCCO_35) U50.R5(VCCO_34) U50.T2(VCCO_34) U50.V6(VCCO_34) U50.W3(VCCO_34)  [also labelled VCCO34_1V5, VCCO35_1V5]
DDR_3V3: C174.2 C175.2 C176.2 C177.2 C182.2 C183.2 C184.2 C185.2 C203.2 C204.2 C205.2 C214.2 C215.2 C219.2 C222.2 C223.2 C432.2 C433.2 C435.2 C436.2 R256.1 U50.AA17(VCCO_13) U50.AB14(VCCO_13) U50.F12(VCCO_0) U50.M14(VCCO_14) U50.P18(VCCO_14) U50.R15(VCCO_14) U50.T12(VCCO_0) U50.T22(VCCO_14) U50.U19(VCCO_14) U50.V16(VCCO_13) U50.W13(VCCO_13) U50.Y10(VCCO_13) U50.Y20(VCCO_14)  [also labelled VCCO0_3V3, VCCO13_3V3, VCCO14_3V3]
GND: C114.2 C137.1 C138.1 C139.1 C140.1 C141.1 C142.1 C143.1 C144.1 C145.1 C146.1 C147.1 C148.1 C149.1 C150.1 C152.1 C153.1 C154.1 C155.1 C158.1 C159.1 C160.1 C161.1 C162.1 C163.1 C164.1 C166.1 C167.1 C168.1 C170.1 C171.1 C172.1 C173.1 C174.1 C175.1 C176.1 C177.1 C178.1 C179.1 C180.1 C181.1 C182.1 C183.1 C184.1 C185.1 C186.1 C187.1 C188.1 C190.1 C191.1 C192.1 C193.1 C194.1 C195.1 C196.1 C199.1 C201.1 C203.1 C204.1 C205.1 C206.1 C207.1 C208.1 C209.1 C210.1 C211.1 C212.1 C213.1 C214.1 C215.1 C216.1 C217.1 C218.1 C219.1 C220.1 C221.1 C222.1 C223.1 C418.1 C419.1 C420.1 C422.1 C423.1 C424.1 C425.1 C426.1 C427.1 C429.1 C431.1 C432.1 C433.1 C435.1 C436.1 U50.A2(GND) U50.A3(GND) U50.A5(GND) U50.A7(GND) U50.A9(GND) U50.A11(GND) U50.A12(GND) U50.A22(GND) U50.AA2(GND) U50.AA12(GND) U50.AA22(GND) U50.AB9(GND) U50.AB19(GND) U50.B3(GND) U50.B12(GND) U50.B19(GND) U50.C3(GND) U50.C6(GND) U50.C10(GND) U50.C12(GND) U50.C16(GND) U50.D3(GND) U50.D4(GND) U50.D8(GND) U50.D12(GND) U50.D13(GND) U50.E4(GND) U50.E5(GND) U50.E7(GND) U50.E9(GND) U50.E11(GND) U50.E20(GND) U50.F5(GND) U50.F11(GND) U50.F17(GND) U50.G5(GND) U50.G6(GND) U50.G7(GND) U50.G8(GND) U50.G9(GND) U50.G10(GND) U50.G12(GND) U50.G14(GND) U50.H1(GND) U50.H7(GND) U50.H9(GND) U50.H11(GND) U50.H21(GND) U50.J8(GND) U50.J10(GND) U50.J12(GND) U50.J18(GND) U50.K5(GND) U50.K7(GND) U50.K11(GND) U50.K15(GND) U50.L2(GND) U50.L8(GND) U50.L22(GND) U50.M7(GND) U50.M11(GND) U50.M19(GND) U50.N6(GND) U50.N8(GND) U50.N16(GND) U50.P3(GND) U50.P7(GND) U50.P9(GND) U50.P11(GND) U50.P13(GND) U50.R8(GND) U50.R10(GND) U50.R12(GND) U50.R20(GND) U50.T7(GND) U50.T9(GND) U50.T11(GND) U50.T17(GND) U50.U4(GND) U50.U14(GND) U50.V1(GND) U50.V11(GND) U50.V21(GND) U50.W8(GND) U50.W18(GND) U50.Y5(GND) U50.Y15(GND)
VCC_1V5: R257.2
VCC_1V8: R255.2
VCC_3V3: R256.2
VCCAUX_1V8: C166.2 C167.2 C168.2 C170.2 C190.2 C191.2 C192.2 C193.2 C194.2 C195.2 C196.2 C199.2 C206.2 C207.2 C208.2 C209.2 C216.2 C220.2 C221.2 C419.2 C420.2 C422.2 C423.2 C424.2 C425.2 C426.2 C427.2 R255.1 U50.A17(VCCO_16) U50.B14(VCCO_16) U50.C21(VCCO_16) U50.D18(VCCO_16) U50.E15(VCCO_16) U50.F22(VCCO_16) U50.G19(VCCO_15) U50.H12(VCCAUX) U50.H16(VCCO_15) U50.J13(VCCO_15) U50.K12(VCCAUX) U50.K20(VCCO_15) U50.L17(VCCO_15) U50.M12(VCCAUX) U50.N21(VCCO_15) U50.P12(VCCAUX) U50.R11(VCCAUX)  [also labelled VCCO15_1V8, VCCO16_1V8]
VOUT_1V: C114.1 C137.2 C138.2 C139.2 C140.2 C141.2 C142.2 C143.2 C144.2 C145.2 C146.2 C147.2 C148.2 C149.2 C150.2 C152.2 C153.2 C154.2 C155.2 C158.2 C159.2 C160.2 C161.2 C162.2 C163.2 C164.2 C171.2 C172.2 C173.2 C201.2 C418.2 U50.H8(VCCINT) U50.H10(VCCINT) U50.J7(VCCINT) U50.J9(VCCINT) U50.J11(VCCBRAM) U50.K8(VCCINT) U50.L7(VCCINT) U50.L11(VCCBRAM) U50.M8(VCCINT) U50.N7(VCCINT) U50.N11(VCCBRAM) U50.P8(VCCINT) U50.P10(VCCINT) U50.R7(VCCINT) U50.R9(VCCINT) U50.T8(VCCINT) U50.T10(VCCINT)  [also labelled VCCBRAM_1V0, VCCINT_1V0]

### Notes on the sheet
- 1
- 2
- 3
- 4
- 5
- 6
- A
- B
- C
- 更新日期
- 2024-08-09
- D
- 原理图
- 图页
- Schematic1
- Power1
- 创建日期
- 物料编码
- 审阅
- 绘制
- prj_extend_and_core_board_7_8
- 版本
- V1.0
- 尺寸
- A4
- 页
- 嘉立创EDA
- 共
- 7

### Library data of the parts
C114 = 6TPE680MI: 容值:680uF;精度:±20%;额定电压:6.3V;等效串联电阻:18mΩ@100kHz;; Manufacturer: PANASONIC(松下); AddInBom: yes; ModelId: 3707aeb7c6124fd1ba335bbd8ce3cbd4; ModelName: CASE-E_L7.3-W4.3-H4.1; ModelTransform: 287.401,169.291,0,180,0,0,0,0,0; Tolerance: ±20%; Rated Voltage: 6.3V; Symbol: 6TPE680MI; Device: 6TPE680MI; Supplier: LCSC; Manufacturer Part: 6TPE680MI; Value: 680uF; Supplier Part: C79115; JLCPCB Part Class: 扩展库; LCSC Part Name: 680uF ±20% 6.3V; Supplier Footprint: CASE-D-7343; Datasheet: https://atta.szlcsc.com/upload/public/pdf/source/20180301/C178383_15198943937361383951.pdf; ConvertToPcb: yes; FootprintName: CAP-SMD_L7.3-W4.3-R-RD; Equivalent Series Resistance(ESR): 18mΩ@100kHz; Operating Temperature: -55℃~+105℃
C137-C142 C150 C152-C155 C199 C201 C203-C214 C424 C425 = CL05A475MQ5NRNC: 容值:4.7uF;精度:±20%;额定电压:6.3V;材质(温度系数):X5R;; Manufacturer: SAMSUNG(三星); Symbol: CL05A475MQ5NRNC_C307423; AddInBom: yes; ModelId: 36a51122f27c49738f86b3bfa98863e0; ModelName: C0402_L1.0-W0.5-H0.5; ModelTransform: 39.37,19.685,0,0,0,0,0,0,0; Tolerance: ±20%; Voltage Rated: 6.3V; Temperature Coefficient: X5R; Device: CL05A475MQ5NRNC; LCSC Part Name: 4.7uF ±20% 6.3V; SupplierPart: C307423; ManufacturerPart: CL05A475MQ5NRNC; Supplier Footprint: 0402; JLCPCB Part Class: 扩展库; Datasheet: https://atta.szlcsc.com/upload/public/pdf/source/20181010/C307423_0E0C4E35F3A09F81C2E5C84E00499E42.pdf; Supplier: LCSC; ConvertToPcb: yes; FootprintName: C0402; Value: 4.7uF
C143-C149 C158-C164 C166-C168 C170-C188 C190-C196 C223 C419 C420 C422 C423 C426 C427 C429 C431-C433 C435 C436 = CL05A474KP5NNNC: as C511 on sheet LED_JTAG; Symbol: CL05A474KP5NNNC; Device: CL05A474KP5NNNC; LCSC Part Name: 470nF ±10% 10V; SupplierPart: C47339; ManufacturerPart: CL05A474KP5NNNC; Supplier Footprint: 0402; JLCPCB Part Class: 扩展库; Datasheet: https://atta.szlcsc.com/upload/public/pdf/source/20160218/1457707763339.pdf; Supplier: LCSC; ConvertToPcb: yes; FootprintName: C0402; Value: 470nF
C215-C222 C418 = GRM188R60J476ME15D: 容值:47uF;精度:±20%;额定电压:6.3V;材质(温度系数):X5R;; Manufacturer: muRata(村田); AddInBom: yes; ModelId: ac125912035d415993ca9572d50418b1; ModelName: C0603_L1.6-W0.8-H0.8; ModelTransform: 62.992,31.496,0,0,0,0,0,0,0; Tolerance: ±20%; Voltage Rated: 6.3V; Temperature Coefficient: X5R; Symbol: GRM188R60J476ME15D; Device: GRM188R60J476ME15D; Supplier: LCSC; Manufacturer Part: GRM188R60J476ME15D; Value: 47uF; Supplier Part: C140782; JLCPCB Part Class: 扩展库; LCSC Part Name: 47uF ±20% 6.3V; Supplier Footprint: 0603; Datasheet: https://atta.szlcsc.com/upload/public/pdf/source/20171113/C140782_15105612981581115778.pdf; ConvertToPcb: yes; FootprintName: C0603
R255-R257 = 0805W8F0000T5E: 电阻类型:厚膜电阻;阻值:0Ω;精度:±1%;功率:125mW;最大工作电压:150V;温度系数:±800ppm/℃;; Manufacturer: UNI-ROYAL(厚声); AddInBom: yes; ModelId: 37a81e68749a4138bd2dfa6897b24b85; ModelName: R0805_L2.0-W1.3-H0.6; ModelTransform: 78.74,51.181,0,0,0,0,0,-0.0005,0; Tolerance: ±1%; Power(Watts): 125mW; Overload Voltage (Max): 150V; Symbol: 0805W8F0000T5E; Device: 0805W8F0000T5E; Supplier: LCSC; Manufacturer Part: 0805W8F0000T5E; Supplier Part: C17477; Value: 0Ω; JLCPCB Part Class: 基础库; LCSC Part Name: 0Ω ±1% 125mW 厚膜电阻; Supplier Footprint: 0805; Datasheet: https://atta.szlcsc.com/upload/public/pdf/source/20200306/C422600_1E6D84923E4A46A82E41ADD87F860B5C.pdf; ConvertToPcb: yes; FootprintName: R0805; Type: 厚膜电阻; Temperature Coefficient: ±800ppm/℃; Operating Temperature Range: -55℃~+155℃
U50 = XC7A200T-2FBG484I: Manufacturer: AMD/XILINX(赛灵思); AddInBom: yes; ModelId: 3abebaa3ee4f462aa6190f543be940e9; ModelTransform: 905.51,905.51,0,0,0,0,0,0,0; JLCPCB Part Class: Extended Part; Symbol: XC7A200T-2FBG484I; Device: XC7A200T-2FBG484I; LCSC Part Name: XC7A200T-2FBG484I -; SupplierPart: C494680; ManufacturerPart: XC7A200T-2FBG484I; Supplier Footprint: FCBGA-484; Datasheet: https://atta.szlcsc.com/upload/public/pdf/source/20200309/C494680_F336422EF4F4583D8575B40FC985FE3D.pdf; Supplier: LCSC; ConvertToPcb: yes; FootprintName: FBGA-484_L23.0-W23.0-R22-C22-P1.00-TL; ModelName: FBGA-484_L23.0-W23.0-R22-C22-P1.00-TL